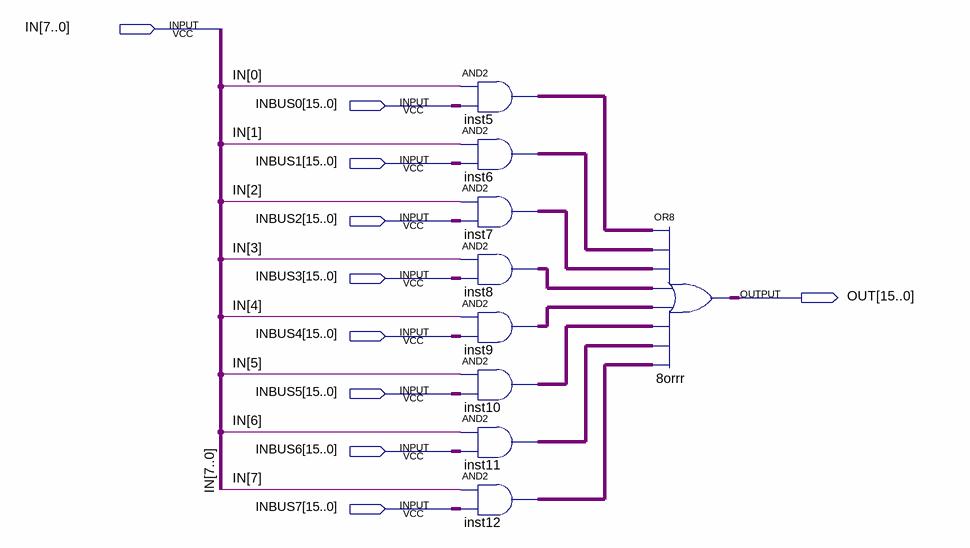
[diagram p0: schematic sheet]
// Quartus schematic 88selector.bdf as structural Verilog: 9 symbols, 10 pins
module \88selector  (
  input  [7:0] IN,
  input  [15:0] INBUS0,
  input  [15:0] INBUS1,
  input  [15:0] INBUS2,
  input  [15:0] INBUS3,
  input  [15:0] INBUS4,
  input  [15:0] INBUS5,
  input  [15:0] INBUS6,
  input  [15:0] INBUS7,
  output [15:0] OUT
);

  wire [15:0] inst5_out, inst6_out, inst7_out, inst8_out, inst9_out, inst10_out, inst11_out, inst12_out;

  assign inst5_out = {16{IN[0]}} & INBUS0;  // AND2 inst5, 16 bits wide
  assign inst6_out = {16{IN[1]}} & INBUS1;  // AND2 inst6, 16 bits wide
  assign inst7_out = {16{IN[2]}} & INBUS2;  // AND2 inst7, 16 bits wide
  assign inst8_out = {16{IN[3]}} & INBUS3;  // AND2 inst8, 16 bits wide
  assign inst9_out = {16{IN[4]}} & INBUS4;  // AND2 inst9, 16 bits wide
  assign inst10_out = {16{IN[5]}} & INBUS5;  // AND2 inst10, 16 bits wide
  assign inst11_out = {16{IN[6]}} & INBUS6;  // AND2 inst11, 16 bits wide
  assign inst12_out = {16{IN[7]}} & INBUS7;  // AND2 inst12, 16 bits wide
  assign OUT = inst5_out | inst6_out | inst7_out | inst8_out | inst9_out | inst10_out | inst11_out | inst12_out;  // OR8 8orrr, 16 bits wide
endmodule
